# Altium schematic sheet buttons_audio_amplifier.SchDoc
size A4; SheetNumber: 3; SheetTotal: 3
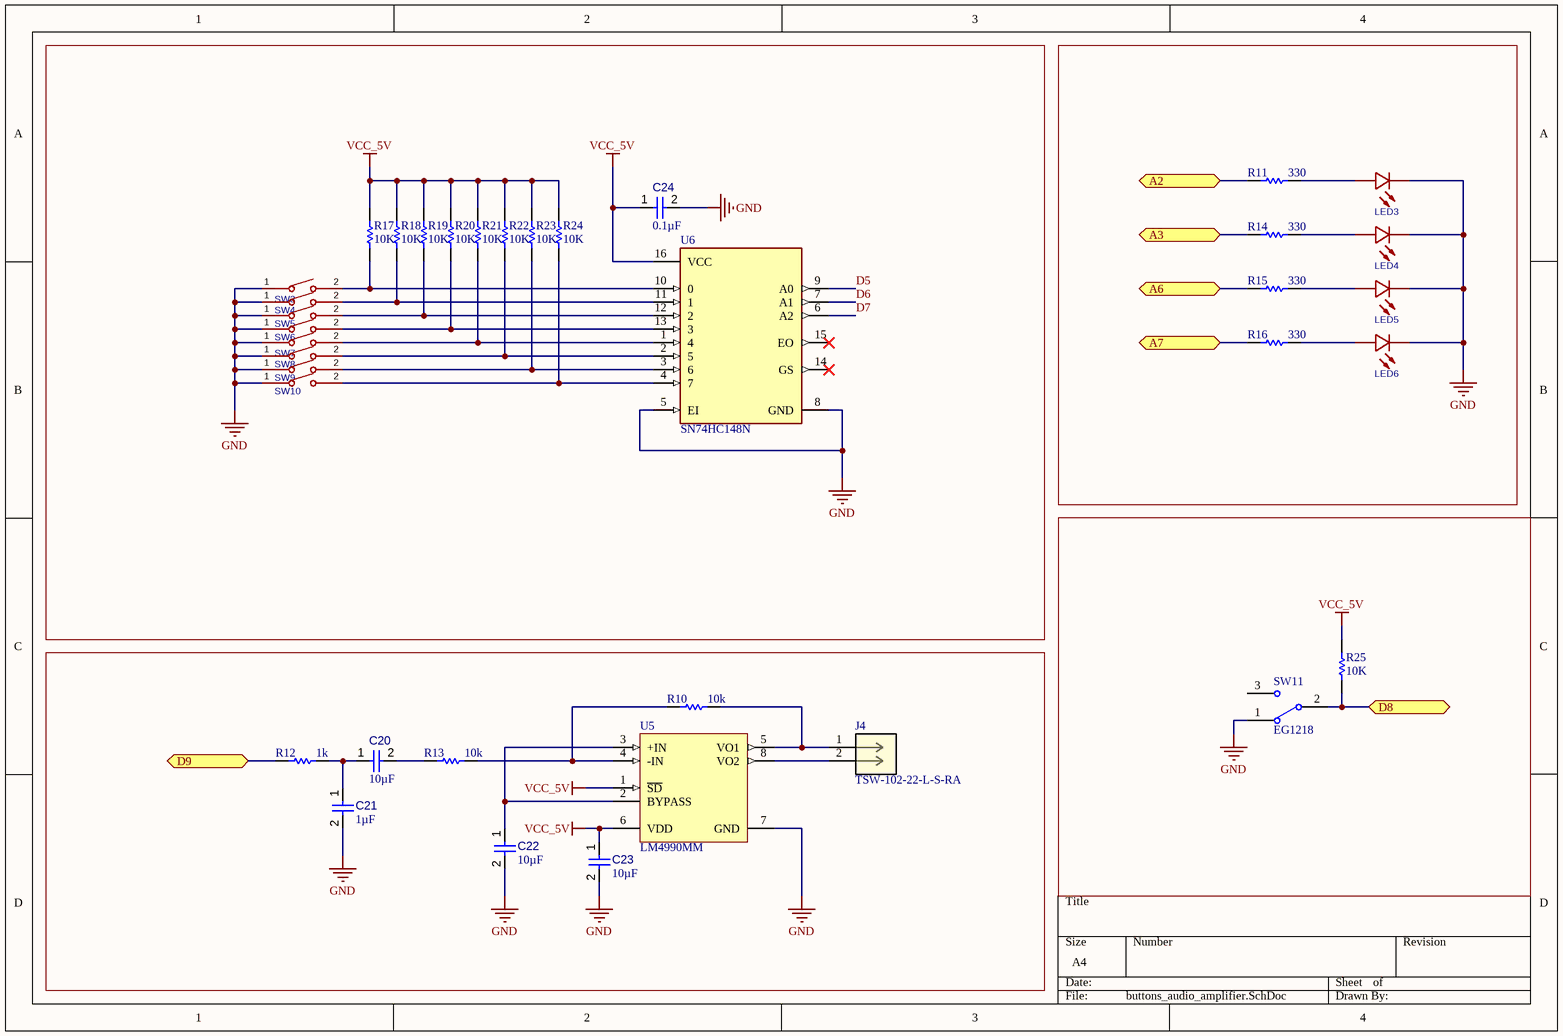
[diagram p0: buttons_audio_amplifier.SchDoc]

## Parts
C20  value 10µF  [CAPC2013X135X45NL10T25]  (hidden comment: Capacitor 10 uF +/- 10% 16 V 0805)
C21  value 1µF  [CAPC2013X135X45NL10T25]  (hidden comment: Capacitor 10 uF +/- 10% 16 V 0805)
C22  value 10µF  [CAPC2013X135X45NL10T25]  (hidden comment: Capacitor 10 uF +/- 10% 16 V 0805)
C23  value 10µF  [CAPC2013X135X45NL10T25]  (hidden comment: Capacitor 10 uF +/- 10% 16 V 0805)
C24  value 0.1µF  [CAPC2013X135X45NL10T25]  (hidden comment: Capacitor 10 uF +/- 10% 16 V 0805)
J4  TSW-102-22-L-S-RA  [CON2_1X2_TR_TSW_SAI]
LED3  FC-DA1608HRK-620D  [LED0603-RD_RED]  (value not drawn)
LED4  FC-DA1608HRK-620D  [LED0603-RD_RED]  (value not drawn)
LED5  FC-DA1608HRK-620D  [LED0603-RD_RED]  (value not drawn)
LED6  FC-DA1608HRK-620D  [LED0603-RD_RED]  (value not drawn)
R10  value 10k  [RESC2013X50X35ML15T15]  (hidden comment: Resistor 0R +/- 1% 0805 125 mW)
R11  value 330  [RESC2013X50X35ML15T15]  (hidden comment: Resistor 0R +/- 1% 0805 125 mW)
R12  value 1k  [RESC2013X50X35ML15T15]  (hidden comment: Resistor 0R +/- 1% 0805 125 mW)
R13  value 10k  [RESC2013X50X35ML15T15]  (hidden comment: Resistor 0R +/- 1% 0805 125 mW)
R14  value 330  [RESC2013X50X35ML15T15]  (hidden comment: Resistor 0R +/- 1% 0805 125 mW)
R15  value 330  [RESC2013X50X35ML15T15]  (hidden comment: Resistor 0R +/- 1% 0805 125 mW)
R16  value 330  [RESC2013X50X35ML15T15]  (hidden comment: Resistor 0R +/- 1% 0805 125 mW)
R17  value 10K  [RESC2013X50X35ML15T15]  (hidden comment: Resistor 0R +/- 1% 0805 125 mW)
R18  value 10K  [RESC2013X50X35ML15T15]  (hidden comment: Resistor 0R +/- 1% 0805 125 mW)
R19  value 10K  [RESC2013X50X35ML15T15]  (hidden comment: Resistor 0R +/- 1% 0805 125 mW)
R20  value 10K  [RESC2013X50X35ML15T15]  (hidden comment: Resistor 0R +/- 1% 0805 125 mW)
R21  value 10K  [RESC2013X50X35ML15T15]  (hidden comment: Resistor 0R +/- 1% 0805 125 mW)
R22  value 10K  [RESC2013X50X35ML15T15]  (hidden comment: Resistor 0R +/- 1% 0805 125 mW)
R23  value 10K  [RESC2013X50X35ML15T15]  (hidden comment: Resistor 0R +/- 1% 0805 125 mW)
R24  value 10K  [RESC2013X50X35ML15T15]  (hidden comment: Resistor 0R +/- 1% 0805 125 mW)
R25  value 10K  [RESC2013X50X35ML15T15]  (hidden comment: Resistor 0R +/- 1% 0805 125 mW)
SW3  TS-1088-AR02016  [SW-SMD_L3.9-W3.0-P4.45]  (value not drawn)
SW4  TS-1088-AR02016  [SW-SMD_L3.9-W3.0-P4.45]  (value not drawn)
SW5  TS-1088-AR02016  [SW-SMD_L3.9-W3.0-P4.45]  (value not drawn)
SW6  TS-1088-AR02016  [SW-SMD_L3.9-W3.0-P4.45]  (value not drawn)
SW7  TS-1088-AR02016  [SW-SMD_L3.9-W3.0-P4.45]  (value not drawn)
SW8  TS-1088-AR02016  [SW-SMD_L3.9-W3.0-P4.45]  (value not drawn)
SW9  TS-1088-AR02016  [SW-SMD_L3.9-W3.0-P4.45]  (value not drawn)
SW10  TS-1088-AR02016  [SW-SMD_L3.9-W3.0-P4.45]  (value not drawn)
SW11  EG1218  [ESWI-EG1218_V]
U5  LM4990MM  [DGK0008A_N]
U6  SN74HC148N  [FP-N0016A-MFG]

## Ports
A2 (bidir, see Simon_game[2C], USB[4B]), A3 (bidir, see Simon_game[2C], USB[4B]), A6 (bidir, see Simon_game[2C], USB[4B]), A7 (bidir, see Simon_game[2C], USB[4B]), D8 (bidir, see Simon_game[2D], USB[4C]), D9 (bidir, see Simon_game[2D], USB[4C])

## Nets
GND: C21.2 C22.2 C23.2 C24.2 LED3.1(K) LED4.1(K) LED5.1(K) LED6.1(K) SW3.1 SW4.1 SW5.1 SW6.1 SW7.1 SW8.1 SW9.1 SW10.1 SW11.1 U5.7(GND) U6.5(EI) U6.8(GND)
VCC_5V: C23.1 C24.1 R17.1 R18.1 R19.1 R20.1 R21.1 R22.1 R23.1 R24.1 R25.1 U5.1(~{SD}) U5.6(VDD) U6.16(VCC)
A2: R11.1 ; port A2
A3: R14.1 ; port A3
A6: R15.1 ; port A6
A7: R16.1 ; port A7
D5: U6.9(A0)
D6: U6.7(A1)
D7: U6.6(A2)
D8: R25.2 SW11.2(COM) ; port D8
D9: R12.1 ; port D9
NetC20_1: C20.1 C21.1 R12.2
NetC20_2: C20.2 R13.1
NetC22_1: C22.1 U5.2(BYPASS) U5.3(+IN)
NetJ4_1: J4.1 R10.2 U5.5(VO1)
NetJ4_2: J4.2 U5.8(VO2)
NetLED3_2: LED3.2(A) R11.2
NetLED4_2: LED4.2(A) R14.2
NetLED5_2: LED5.2(A) R15.2
NetLED6_2: LED6.2(A) R16.2
NetR10_1: R10.1 R13.2 U5.4(-IN)
NetR17_2: R17.2 SW3.2 U6.10(0)
NetR18_2: R18.2 SW4.2 U6.11(1)
NetR19_2: R19.2 SW5.2 U6.12(2)
NetR20_2: R20.2 SW6.2 U6.13(3)
NetR21_2: R21.2 SW7.2 U6.1(4)
NetR22_2: R22.2 SW8.2 U6.2(5)
NetR23_2: R23.2 SW9.2 U6.3(6)
NetR24_2: R24.2 SW10.2 U6.4(7)

Not connected (* = marked no-connect by the designer): SW11 3; U6 14(GS)* 15(EO)*

## Library data of the parts
C20-C24 = CMP-001-00015-6: Chip Capacitor, 10 uF, +/- 10%, 16 V, 0805 (2012 Metric); Voltage Rating: 16V; Capacitor Type: Ceramic; RoHS Compliant: True; Max Operating Temperature: 85°C; Min Operating Temperature: -55°C; Mounting Technology: SM; Tolerance: 10%; Case/Package: 0805; Pins: 2
J4 = TSW-102-22-L-S-RA: No Description Available; Manufacturer_Name: Samtec Inc; Copyright: Copyright (C) 2026 Ultra Librarian. All rights reserved.; Manufacturer_Part_Number: TSW-102-22-L-S-RA; RefDes: RefDes; Type: Type
R10-R25 = CMP-009-00001-5: Chip Resistor, 0 Ohm, +/- 1%, 125 mW, -55 to 155 degC, 0805 (2012 Metric); Voltage Rating: 150V; Power: 125mW; Mounting Technology: SM; Max Operating Temperature: 155°C; Case/Package: 0805; RoHS Compliant: True; Pins: 2; Min Operating Temperature: -55°C; Tolerance: 1%
SW11 = CMP-1696-00002-1: Slide Switch, 500 V, -20 to 70 degC, 3-Pin THD, RoHS; Case\Package: SOT-23-5; Output Current: 150 mA; Nominal Output Voltage: 3.3 V; Max Power Dissipation: 250 mW; Min Input Voltage: 4.3 V; Outputs: 1; Max Input Voltage: 8 V; Dropout Voltage: 300 mV; PackageDescription: 3-Pin Through Hole Device, Body 11.6 x 4 mm, Pitch 2.5 mm; ComponentLink1URL: http://www.e-switch.ch/en/; RoHSCompliant: true; Length: 3 mm; ComponentLink1Description: Manufacturer URL; Power Rating: 250 mW; Mount: Surface Mount; Max Operating Temperature: 85 degC; REACH SVHC: No SVHC; Radiation Hardening: No; Height: 1.3 mm; Pins: 5; Max Ouput Current: 150 mA; Output Voltage: 3.3 V; Width: 1.8 mm; Package Quantity: 3000; ComponentLink2URL: https://www.e-switch.com/system/asset/product_line/data_sheet/119/EG.pdf; Min Operating Temperature: -40 degC; ComponentLink2Description: Datasheet; DatasheetVersion: Oct-15; PackageReference: EG1218; Packaging: Tape and Reel
U5 = CMP-0057-00586-3: 2W Audio Power Amplifier with Selectable Shutdown Logic Level, 8-pin Mini SOIC; Manufacturer: Texas Instruments; PowerWise: N; CompType: Audio IC; PackageTopMarking: ZXTT*GA5; ComponentLink1Description: Datasheet URL; ComponentLink1URL: http://www.ti.com/general/docs/lit/getliterature.tsp?genericPartNumber=LM4990&fileType=pdf; PackageReference: DGK0008A; Code_JEDEC: MO-187-AA; RoHS: N; PinCount: 8; PackageDescription: MINI SOIC, .118 x .118 x .034in, 8 Lead, .0256in Pitch
U6 = CMP-1633-00702-3: IC PRIORITY ENCOD 1 X 8:3 16DIP; Logic Function: Multiplexer; Turn-On Delay Time: 245ns; Supply Type: Single; Min Supply Voltage: 2V; Number of Input Lines: 8; Independent Circuits: 1; Operating Supply Voltage: 5V; High Level Output Current: 5.2mA; Bandwidth: 28MHz; Max Supply Voltage: 6V; Number of Output Lines: 3; Nominal Supply Current: 100uA; Case/Package: PDIP; Height: 4.57mm; Contact Plating: Gold; Length: 19.3mm; Mount: Through Hole; REACH SVHC: No SVHC; Propagation Delay: 245ns; Min Operating Temperature: -40°C; Number of Circuits: 1; Number of Pins: 16; Lead Free: Lead Free; Packaging: Rail/Tube; Radiation Hardening: No; Weight: 0.03357oz; Max Operating Temperature: 85°C; Number of Bits: 8; Width: 6.35mm; Number of Channels: 1; RoHS Compliant: Yes; Package Quantity: 25; Number of Outputs: 3; Number of Inputs: 8; Low Level Output Current: 5.2mA
LED3-LED6 = FC-DA1608HRK-620D: Symbol: FC-DA1608HRK-620D
SW3-SW10 = TS-1088-AR02016: Symbol: TS-1088-AR02016